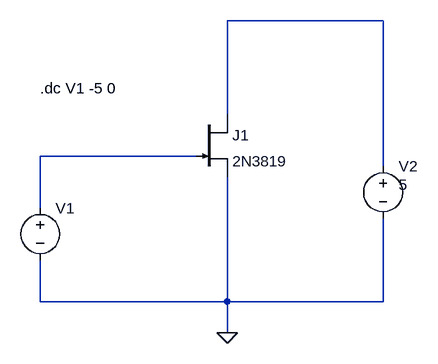
[diagram p0: schematic Experiment 9.asc]
Experiment 9.asc, the LTspice schematic file:
Version 4
SHEET 1 880 680
WIRE 672 -80 432 -80
WIRE 432 64 432 -80
WIRE 384 128 144 128
WIRE 672 144 672 -80
WIRE 144 208 144 128
WIRE 144 352 144 288
WIRE 432 352 432 160
WIRE 432 352 144 352
WIRE 672 352 672 224
WIRE 672 352 432 352
WIRE 432 400 432 352
FLAG 432 400 0
SYMBOL voltage 672 128 R0
WINDOW 123 0 0 Left 0
WINDOW 39 0 0 Left 0
WINDOW 3 24 44 Left 2
SYMATTR InstName V2
SYMATTR Value 5
SYMBOL njf 384 64 R0
SYMATTR InstName J1
SYMATTR Value 2N3819
SYMBOL voltage 144 192 R0
WINDOW 123 0 0 Left 0
WINDOW 39 24 124 Left 2
WINDOW 3 24 44 Left 2
SYMATTR InstName V1
SYMATTR Value ""
TEXT 144 24 Left 2 !.dc V1 -5 0

The netlist it stands for:
* Experiment 9.asc
V2 N001 0 5
J1 N001 N002 0 2N3819
V1 N002 0
.model NJF NJF
.model PJF PJF
.lib standard.jft
.dc V1 -5 0
.backanno
.end

* Results of the author's LTspice run, read from the files saved beside the schematic
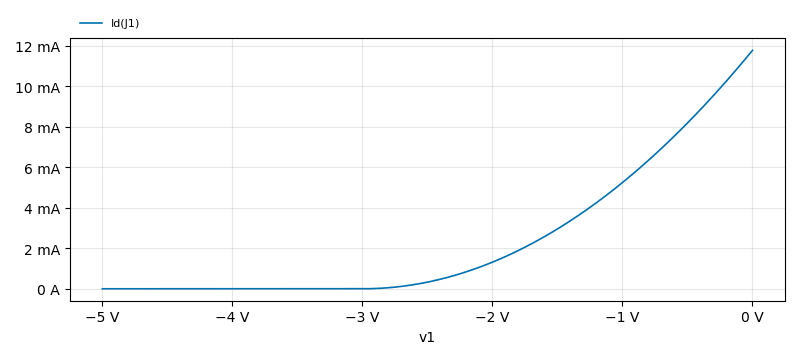
[diagram p1: DC transfer characteristic of Experiment 9.asc, plotted from the saved traces]
* DC transfer characteristic, 1 run:
*   Id(J1): 10.8 pA at v1=-5 V, 11.77 mA at v1=0 V, min 8.748 pA, max 11.77 mA